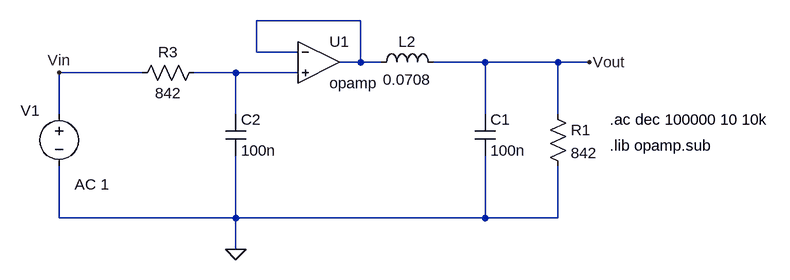
[diagram p0: schematic circuito.asc]
circuito.asc, the LTspice schematic file:
Version 4
SHEET 1 932 680
WIRE 160 128 0 128
WIRE 0 176 0 128
WIRE 64 176 0 176
WIRE 160 192 160 128
WIRE 160 192 128 192
WIRE 192 192 160 192
WIRE 352 192 272 192
WIRE 464 192 352 192
WIRE 512 192 464 192
WIRE -176 208 -304 208
WIRE -32 208 -96 208
WIRE 64 208 -32 208
WIRE -304 272 -304 208
WIRE -32 272 -32 208
WIRE 352 272 352 192
WIRE 464 272 464 192
WIRE -304 432 -304 352
WIRE -32 432 -32 336
WIRE -32 432 -304 432
WIRE 352 432 352 336
WIRE 352 432 -32 432
WIRE 464 432 464 352
WIRE 464 432 352 432
WIRE -32 480 -32 432
FLAG -304 208 Vin
FLAG 512 192 Vout
FLAG -32 480 0
SYMBOL voltage -304 256 R0
WINDOW 123 24 124 Left 2
WINDOW 39 0 0 Left 0
WINDOW 0 -59 10 Left 2
SYMATTR Value2 AC 1
SYMATTR InstName V1
SYMATTR Value ""
SYMBOL OpAmps\\opamp 96 128 R0
SYMATTR InstName U1
SYMBOL ind 176 208 R270
WINDOW 0 32 56 VTop 2
WINDOW 3 5 56 VBottom 2
SYMATTR InstName L2
SYMATTR Value 0.0708
SYMBOL cap 336 272 R0
SYMATTR InstName C1
SYMATTR Value 100n
SYMBOL res -80 192 R90
WINDOW 0 0 56 VBottom 2
WINDOW 3 32 56 VTop 2
SYMATTR InstName R3
SYMATTR Value 842
SYMBOL cap -48 272 R0
SYMATTR InstName C2
SYMATTR Value 100n
SYMBOL res 448 256 R0
SYMATTR InstName R1
SYMATTR Value 842
TEXT 544 320 Left 2 !.lib opamp.sub
TEXT 544 280 Left 2 !.ac dec 100000 10 10k

The netlist it stands for:
* circuito.asc
V1 Vin 0 AC 1
XU1 N001 N002 N001 opamp Aol=100K GBW=10Meg  ; pins invin noninvin out
L2 N001 Vout 0.0708
C1 Vout 0 100n
R3 N002 Vin 842
C2 N002 0 100n
R1 Vout 0 842
.lib opamp.sub
.ac dec 100000 10 10k
.backanno
.end